# EasyEDA schematic SC_Star_EasyEDA.json
TITLE: Star; REV: 1.0; Date: 2024-11-27; Sheet: 1/1; Drawn By: Nekhil R; Company: Coders Cafe
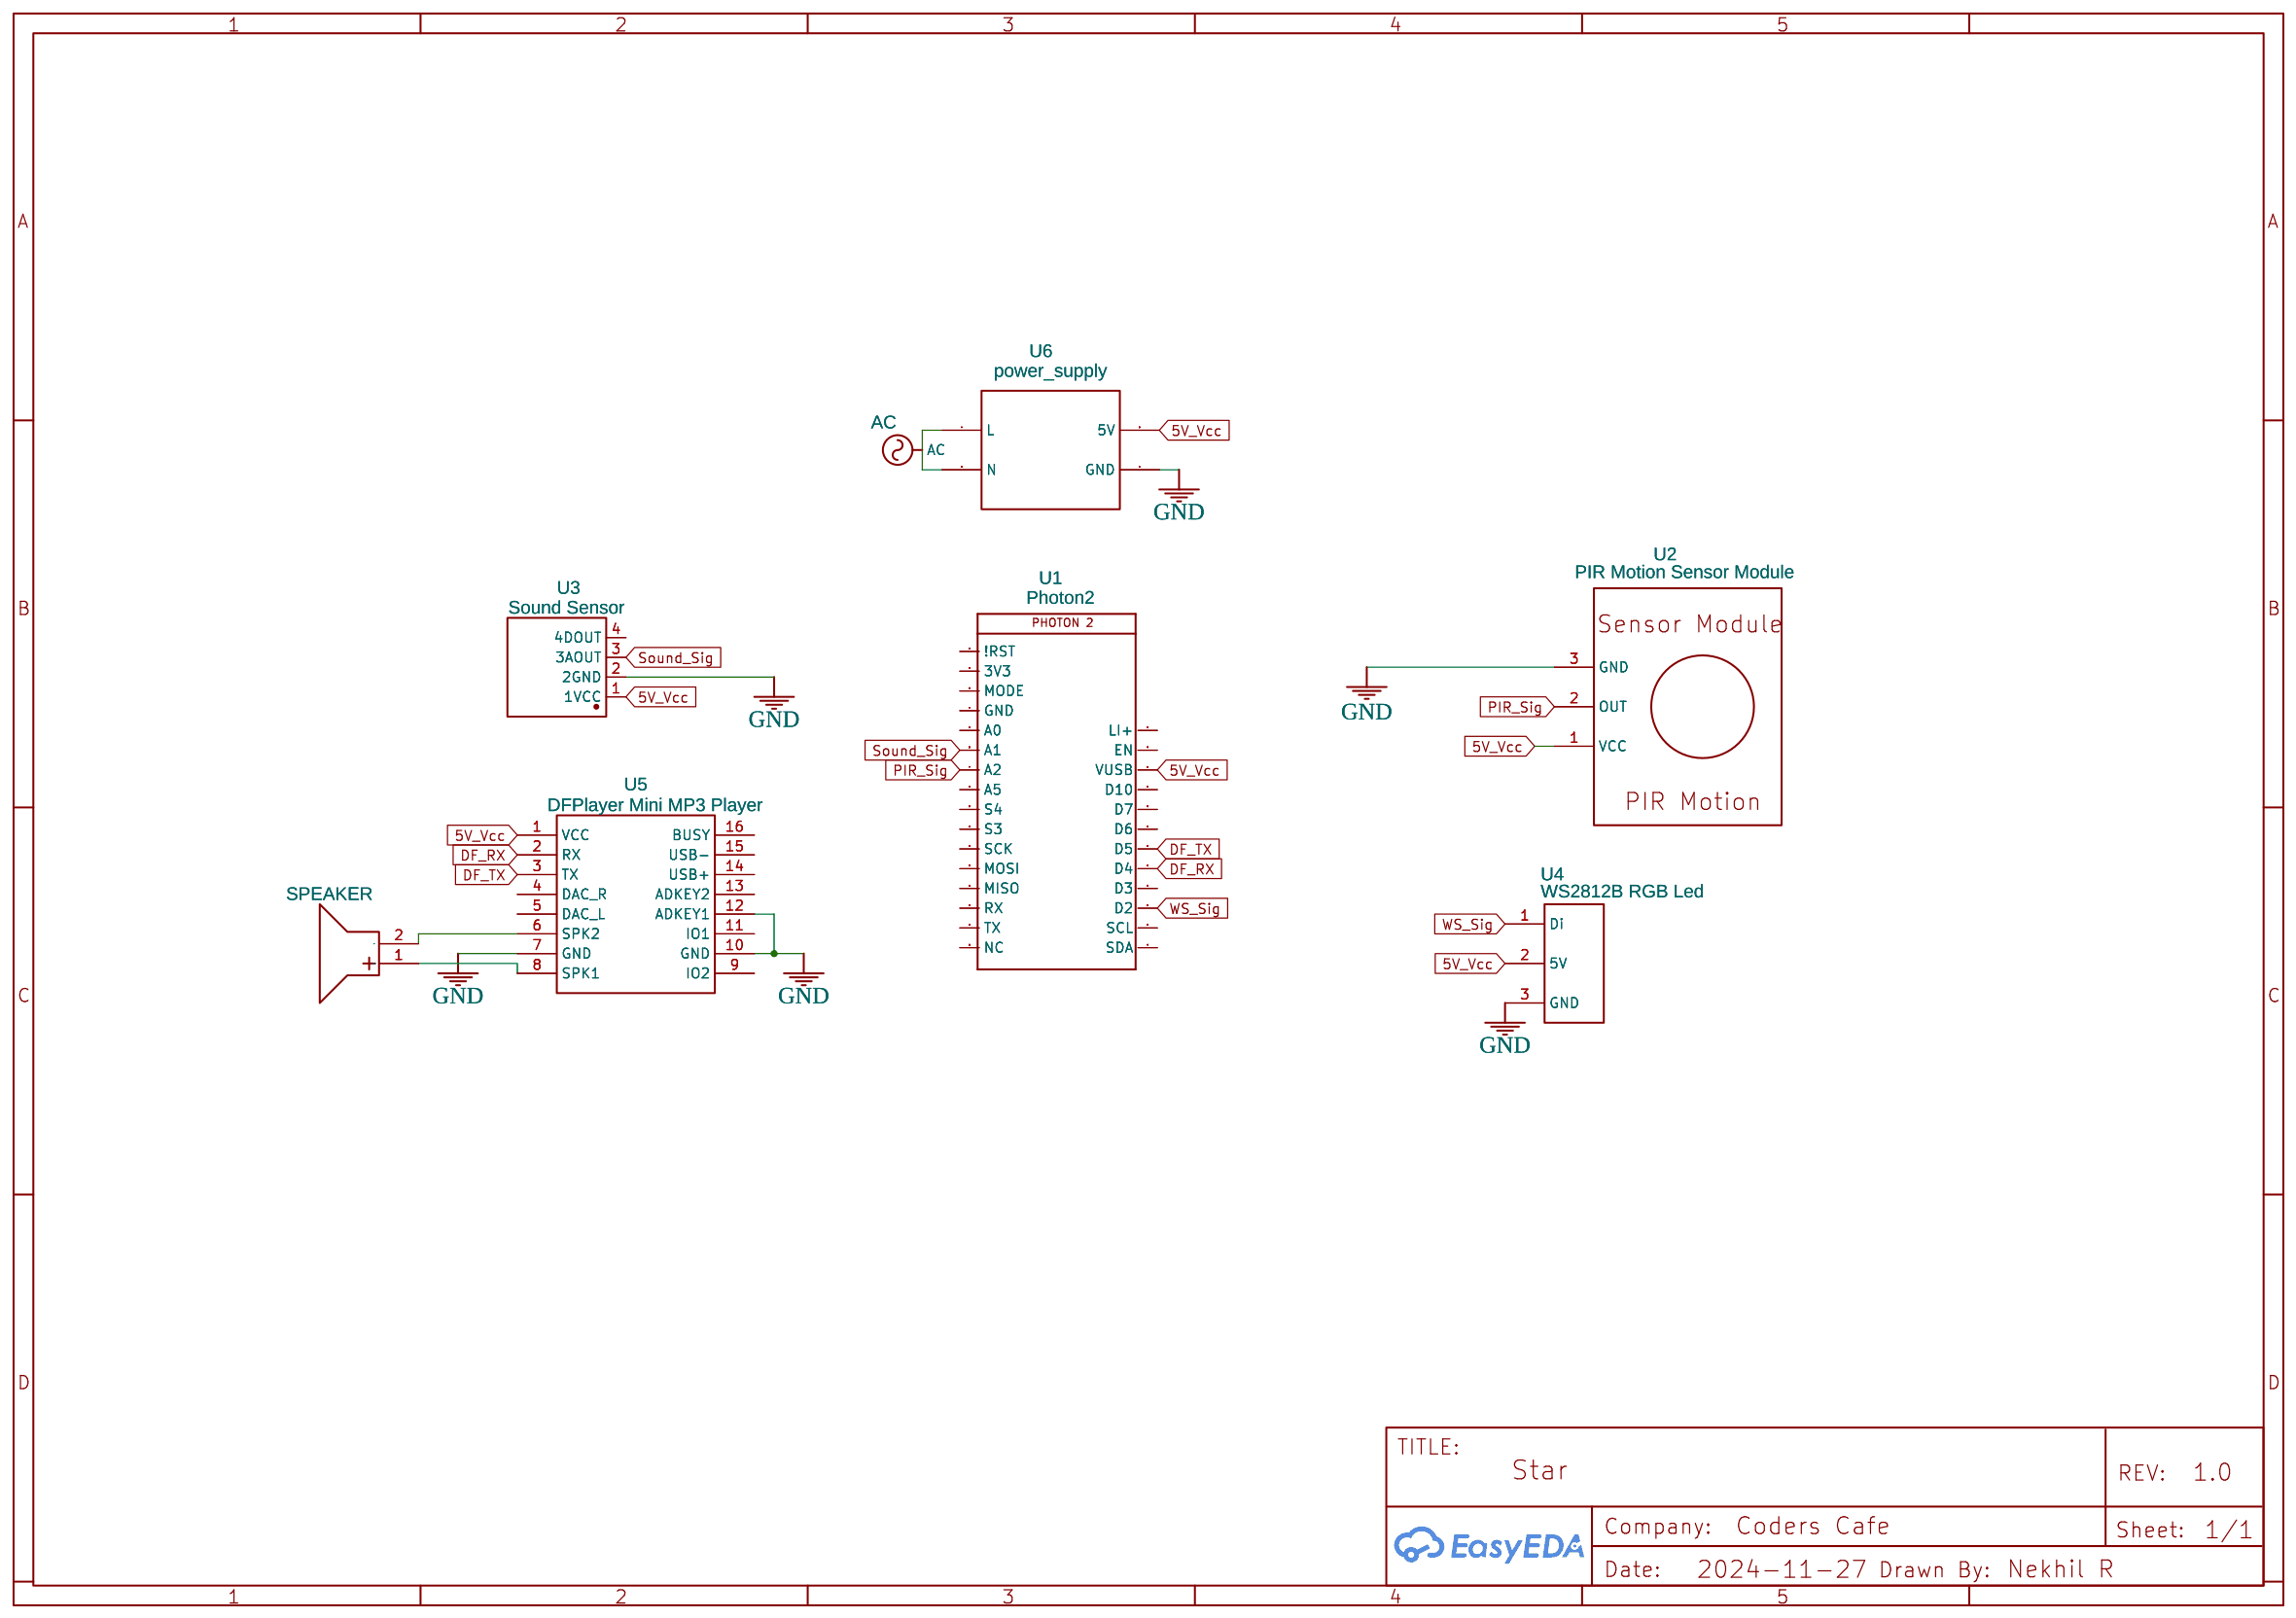
[diagram p0: schematic sheet]

## Parts
#PWR1  AC
SPEAKER  SPEAKER  [SPEAKER-30MM-8OHM-0.5W-TH]
U1  Photon2  [PHOTON 2]
U2  PIR Motion Sensor Module  [PIRMOTIONSENSOR]
U3  Sound Sensor  [WAVESHARE SOUND SENSOR]
U4  WS2812B RGB Led  [NEOPIXEL_RING]
U5  DFPlayer Mini MP3 Player  [DFPLAYER MINI MP3 PLAYER MODULE]
U6  power_supply  [POWER-SUPPLY-NO33]

## Library data of the parts
#PWR1 = AC: Contributor: abhinavjain
SPEAKER = SPEAKER-30mm-8ohm-0.5w-TH: Supplier: LCSC; Supplier Part: C249440; Manufacturer: Dongguan Bolin Elec; Manufacturer Part: BL-PBZ12065C2705YA; Contributor: LCSC
U1 = Photon2: Contributor: stm90285
U2 = PIR Motion Sensor Module: Contributor: raihan muhammad saprudin
U3 = Waveshare Sound Sensor: Contributor: dwipanjan
U4 = Neopixel ring: Contributor: keenan510
U5 = DFPlayer Mini MP3 Player module: link: http://image.dfrobot.com/image/data/DFR0299/DFPlayer%20Mini%20Manul.pdf; Contributor: hs3uka
U6 = power_supply: Contributor: feleps321

## Nets
5V_Vcc: U1.26(VUSB) U2.1(VCC) U3.1(1VCC) U4.2(5V) U5.1(VCC) U6.3(5V)
GND: U2.3(GND) U3.2(2GND) U4.3(GND) U5.7(GND) U5.10(GND) U5.12(ADKEY1) U6.4(GND)
DF_RX: U1.21(D4) U5.2(RX)
DF_TX: U1.22(D5) U5.3(TX)
PIR_Sig: U1.7(A2) U2.2(OUT)
Sound_Sig: U1.6(A1) U3.3(3AOUT)
WS_Sig: U1.19(D2) U4.1(Di)
Net-(#PWR1-1): #PWR1.1(AC) U6.1(L) U6.2(N)
Net-(SPEAKER-1): SPEAKER.1(+) U5.8(SPK1)
Net-(SPEAKER-2): SPEAKER.2(-) U5.6(SPK2)

Not connected (* = marked no-connect by the designer): U1 1(!RST) 2(3V3) 3(MODE) 4(GND) 5(A0) 8(A5) 9(S4) 10(S3) 11(SCK) 12(MOSI) 13(MISO) 14(RX) 15(TX) 16(NC) 17(SDA) 18(SCL) 20(D3) 23(D6) 24(D7) 25(D10) 27(EN) 28(LI+); U3 4(4DOUT); U5 4(DAC_R) 5(DAC_L) 9(IO2) 11(IO1) 13(ADKEY2) 14(USB+) 15(USB-) 16(BUSY)
